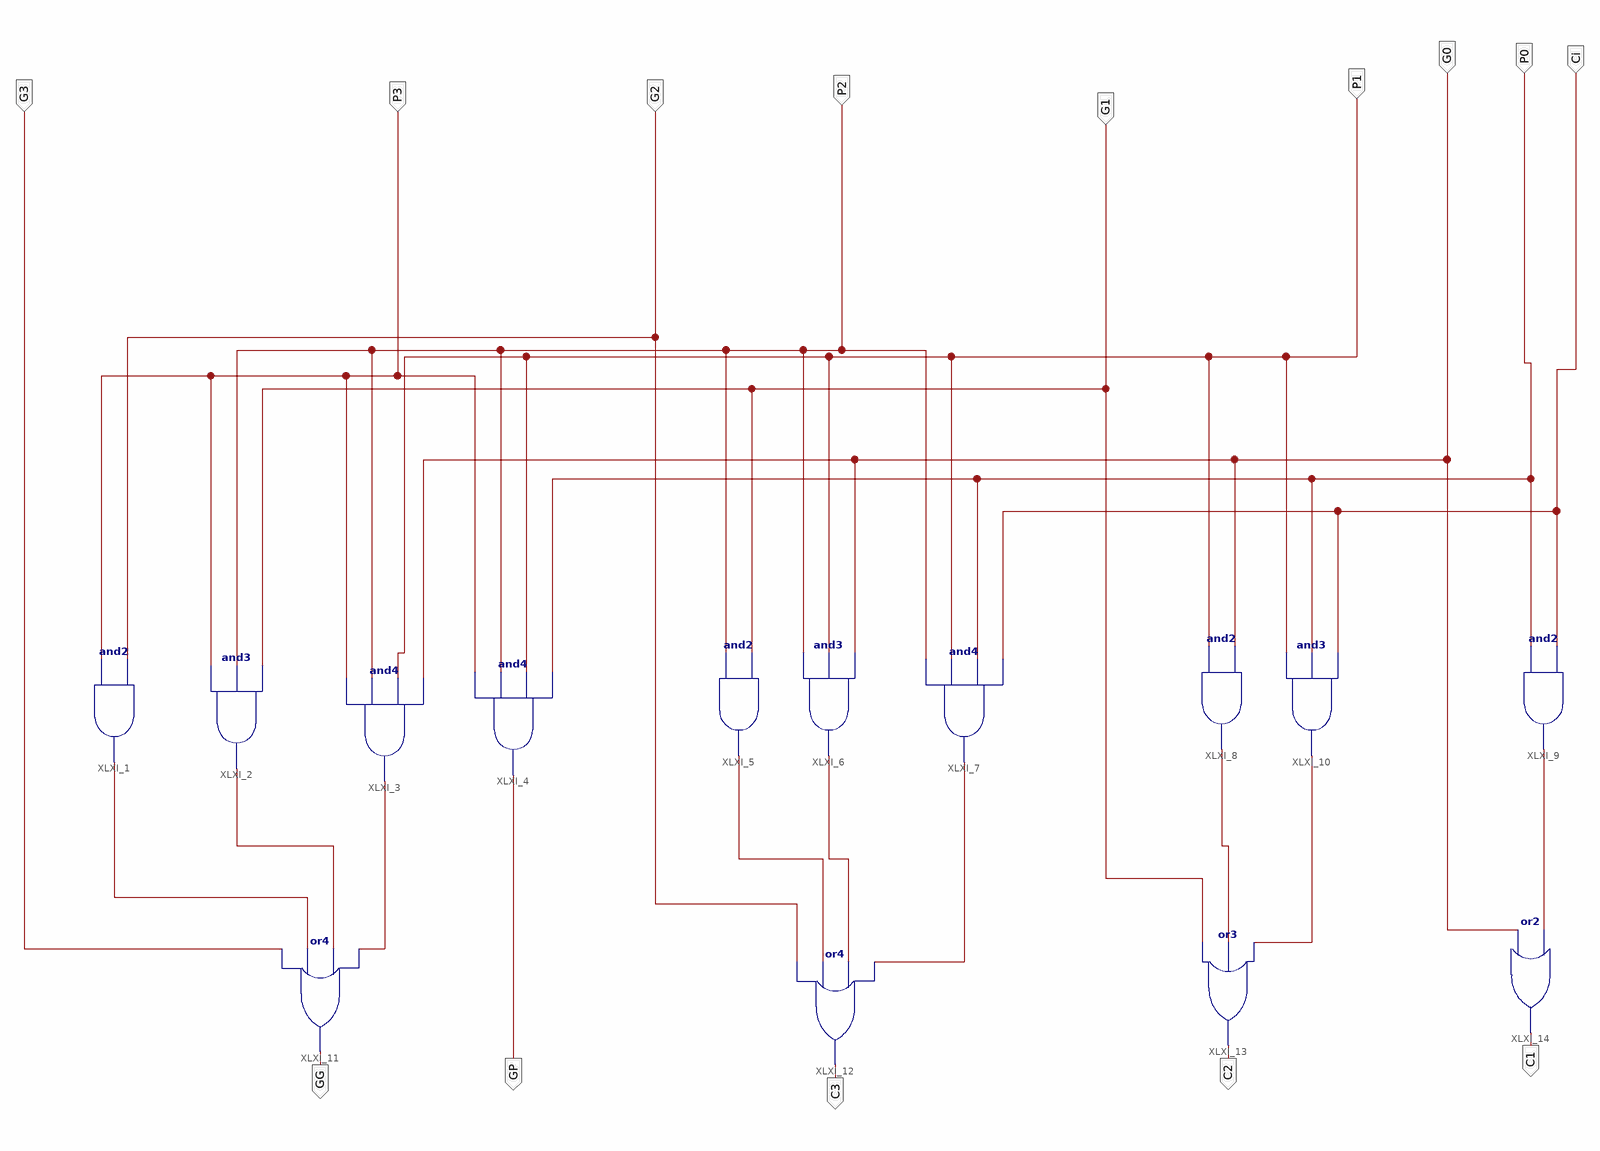
[diagram p0: schematic sheet 1]
// Xilinx ISE schematic CLA.sch (kintex7) as structural Verilog: 14 symbols, 14 ports
module CLA (
  input  P3,
  input  G2,
  input  P1,
  input  G1,
  input  P2,
  input  P0,
  input  G0,
  input  Ci,
  input  G3,
  output GG,
  output C3,
  output C2,
  output C1,
  output GP
);

  wire XLXN_20, XLXN_21, XLXN_22, XLXN_30, XLXN_31, XLXN_32, XLXN_34, XLXN_35, XLXN_37;

  and XLXI_1 (XLXN_20, P3, G2);
  and XLXI_2 (XLXN_21, P3, P2, G1);
  and XLXI_3 (XLXN_22, P3, P2, P1, G0);
  and XLXI_4 (GP, P3, P2, P1, P0);
  and XLXI_5 (XLXN_30, P2, G1);
  and XLXI_6 (XLXN_31, P2, P1, G0);
  and XLXI_7 (XLXN_32, P2, P1, P0, Ci);
  and XLXI_8 (XLXN_34, P1, G0);
  and XLXI_10 (XLXN_35, P1, P0, Ci);
  and XLXI_9 (XLXN_37, P0, Ci);
  or XLXI_11 (GG, G3, XLXN_20, XLXN_21, XLXN_22);
  or XLXI_12 (C3, G2, XLXN_30, XLXN_31, XLXN_32);
  or XLXI_13 (C2, G1, XLXN_34, XLXN_35);
  or XLXI_14 (C1, G0, XLXN_37);
endmodule
